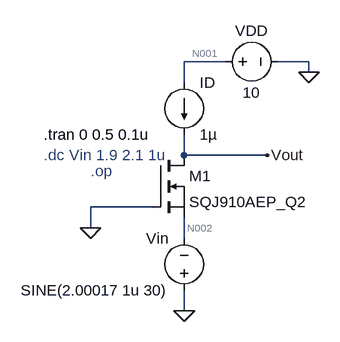
[diagram p0: schematic mos_cg_vgs.asc]
mos_cg_vgs.asc, the LTspice schematic file:
Version 4.1
SHEET 1 880 680
WIRE 256 -48 192 -48
WIRE 384 -48 336 -48
WIRE 384 -32 384 -48
WIRE 192 -16 192 -48
WIRE 192 96 192 64
WIRE 320 96 192 96
WIRE 144 176 48 176
WIRE 48 208 48 176
WIRE 192 224 192 192
WIRE 192 336 192 304
FLAG 384 -32 0
FLAG 320 96 Vout
FLAG 48 208 0
FLAG 192 336 0
SYMBOL nmos 144 96 R0
SYMATTR InstName M1
SYMATTR Value SQJ910AEP_Q2
SYMBOL current 192 -16 R0
WINDOW 123 0 0 Left 0
WINDOW 39 0 0 Left 0
SYMATTR InstName ID
SYMATTR Value 1µ
SYMBOL voltage 240 -48 R270
WINDOW 0 32 56 VTop 2
WINDOW 3 -32 56 VBottom 2
WINDOW 123 0 0 Left 0
WINDOW 39 0 0 Left 0
SYMATTR InstName VDD
SYMATTR Value 10
SYMBOL voltage 192 320 R180
WINDOW 0 24 96 Left 2
WINDOW 3 24 16 Left 2
WINDOW 123 0 0 Left 0
WINDOW 39 0 0 Left 0
SYMATTR InstName Vin
SYMATTR Value SINE(2.00017 1u 30)
TEXT 48 120 Left 2 ;.op
TEXT -24 96 Left 2 ;.dc Vin 1.9 2.1 1u
TEXT -24 64 Left 2 !.tran 0 0.5 0.1u

The netlist it stands for:
* mos_cg_vgs.asc
M1 Vout 0 N002 N002 SQJ910AEP_Q2
ID N001 Vout 1µ
VDD N001 0 10
Vin 0 N002 SINE(2.00017 1u 30)
.model NMOS NMOS
.model PMOS PMOS
.lib standard.mos
* .op
* .dc Vin 1.9 2.1 1u
.tran 0 0.5 0.1u
.backanno
.end

* Results of the author's LTspice run, read from the files saved beside the schematic
* Operating Point, zero values left out:
*   V(n002) = -2 V
*   V(vout) = 111.5 V
*   V(n001) = 10 V
*   Id(M1) = 999.9 nA
*   Is(M1) = -999.9 nA
*   I(VDD) = -1 µA
*   I(ID) = 1 µA
*   I(Vin) = -1 µA
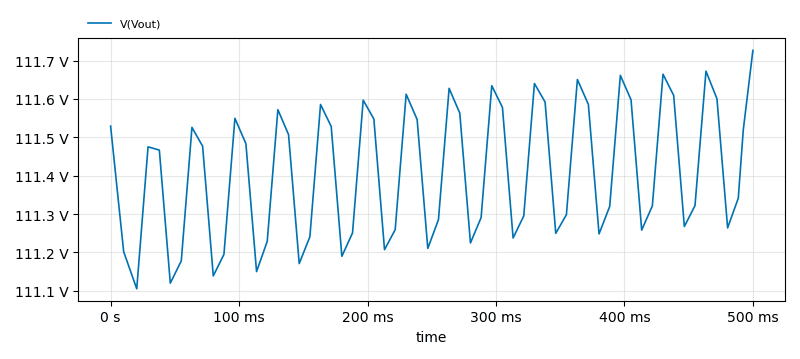
[diagram p1: Transient Analysis of mos_cg_vgs.asc, plotted from the saved traces]
* Transient Analysis, 1 run:
*   V(Vout): min 111.1 V, max 111.7 V, average 111.4 V, rms 111.4 V, last 111.7 V